# EasyEDA schematic SCH_Irrigation_controller_2022-02-15.json
TITLE: Irrigation Controller; REV: 1.0; Date: 2022-02-15; Sheet: 1/1; Drawn By: Fabrizio Fiorucci; Company: 65397
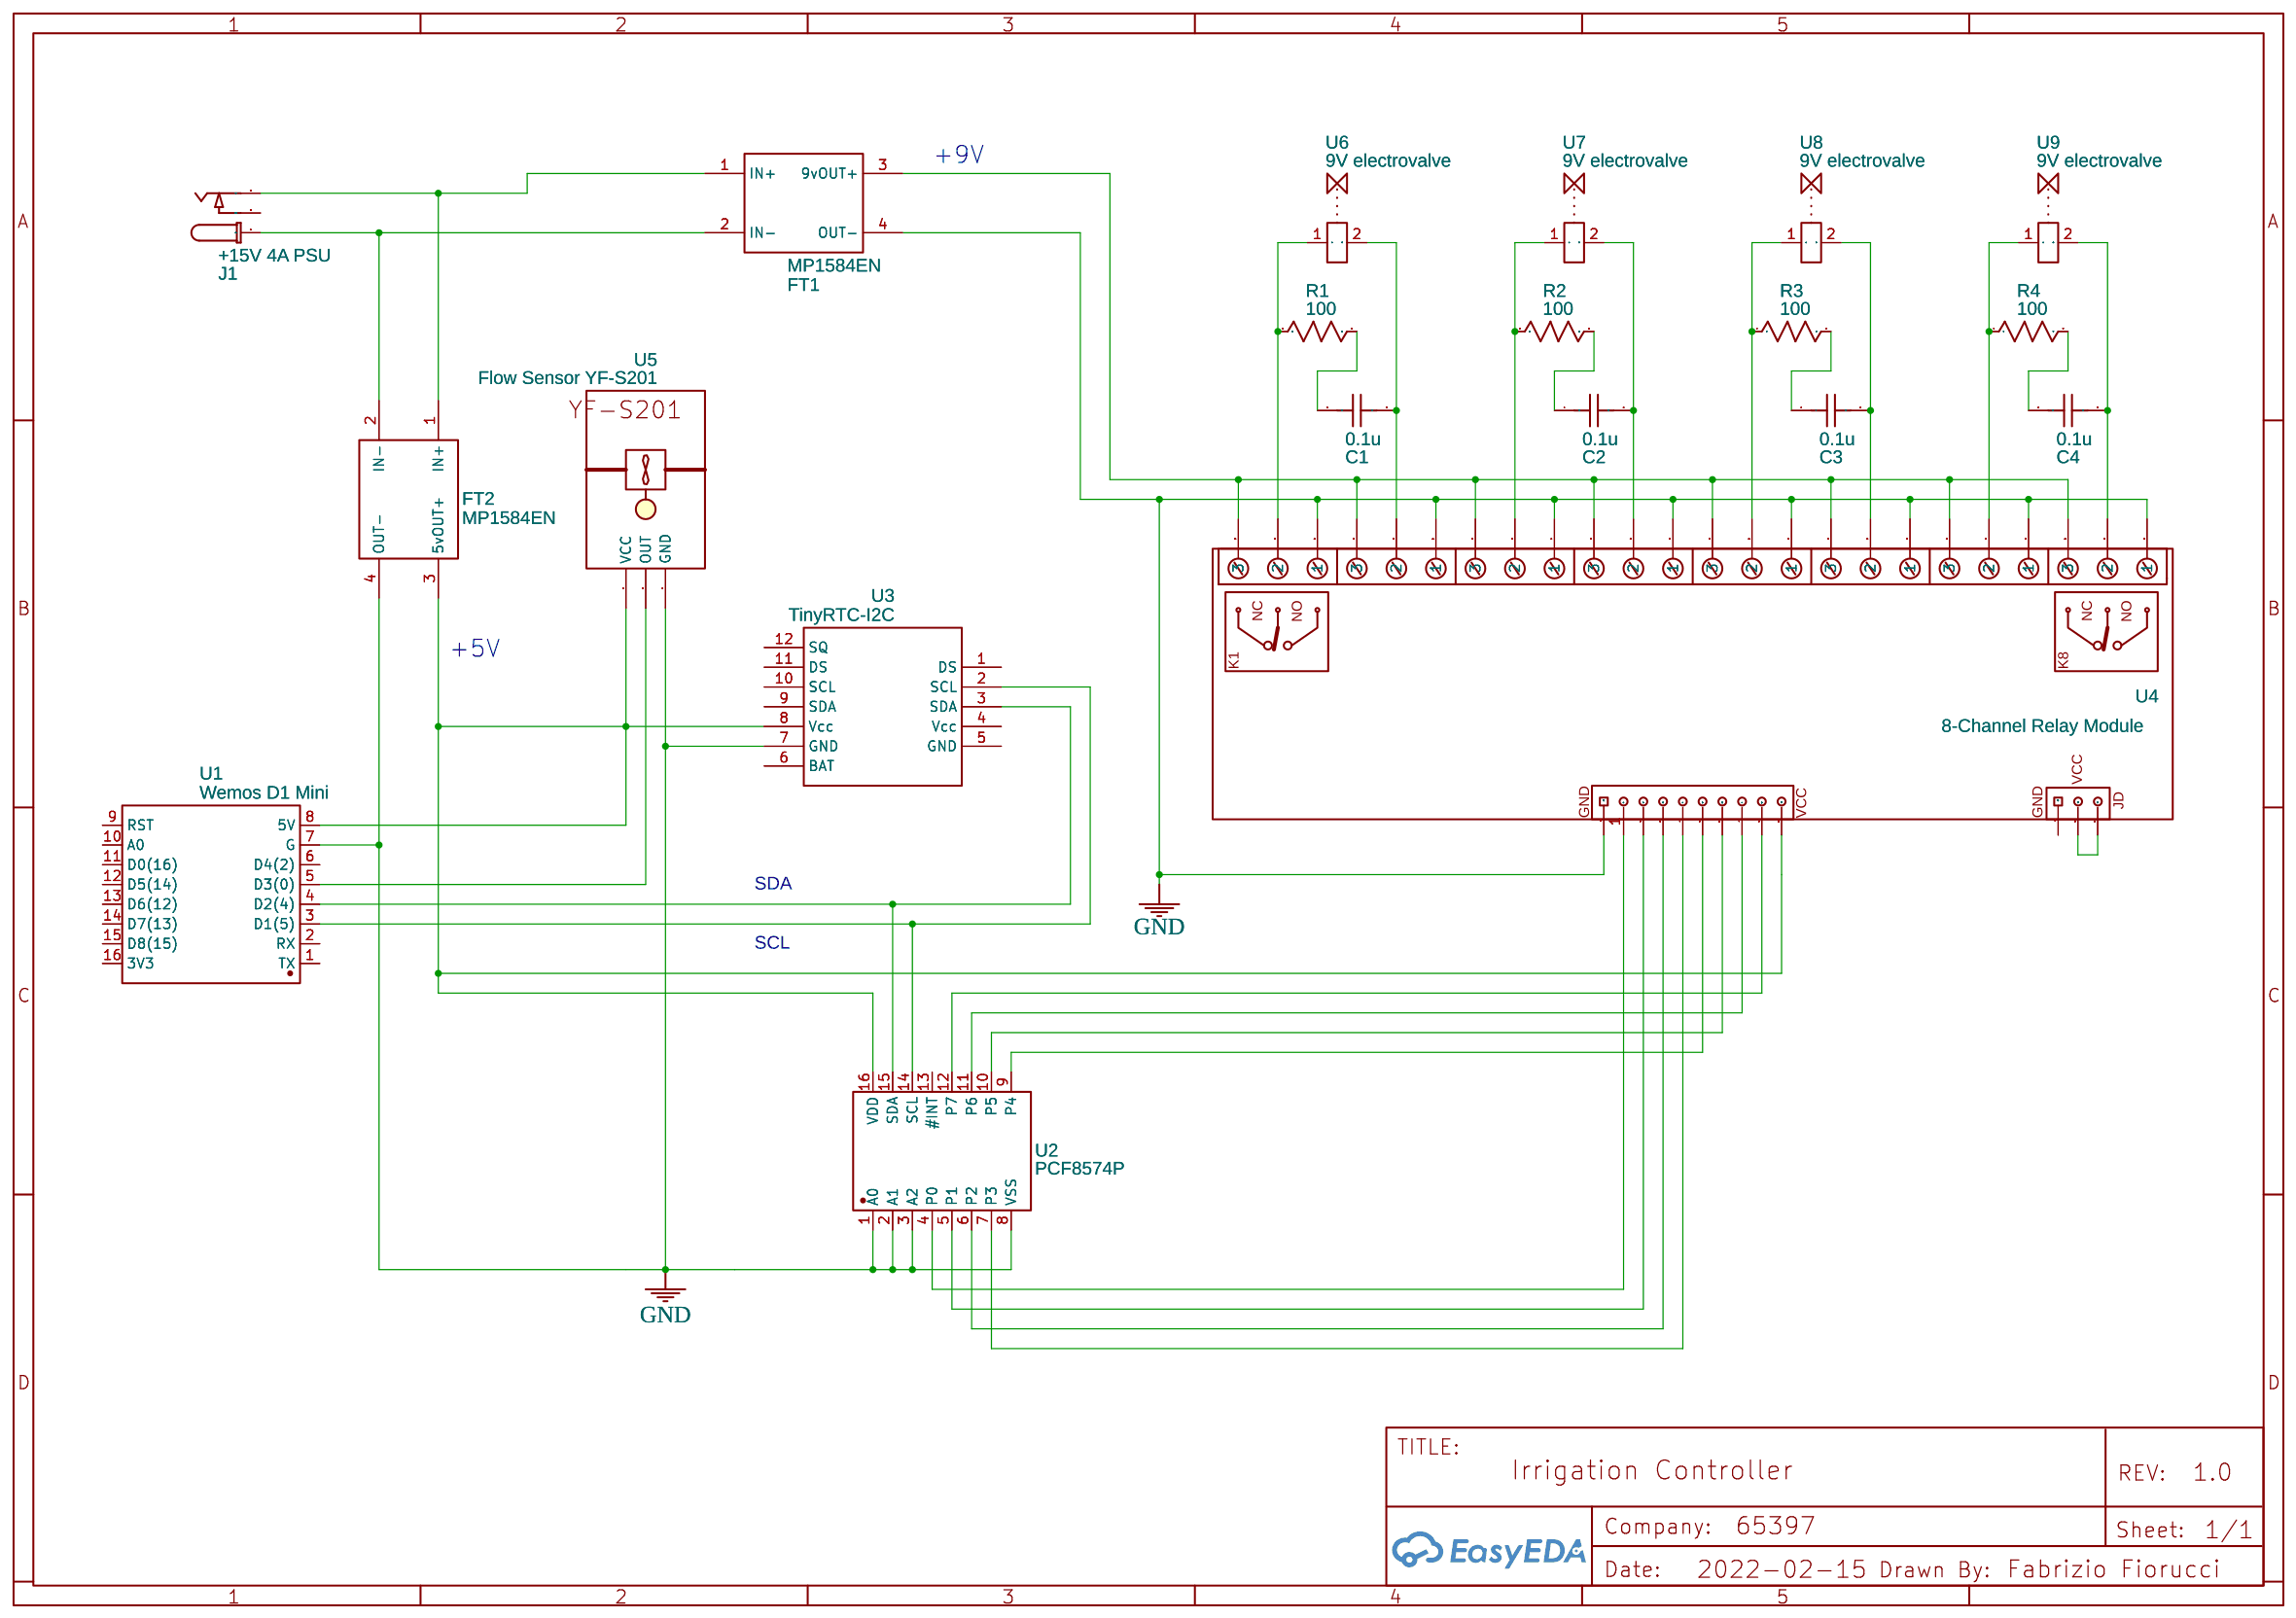
[diagram p0: schematic sheet]

## Parts
C1  0.1u  [C0603]
C2  0.1u  [C0603]
C3  0.1u  [C0603]
C4  0.1u  [C0603]
FT1  MP1584EN  [MP1584EN]
FT2  MP1584EN  [MP1584EN]
J1  +15V 4A PSU  [DC_BARREL_JACK_PTH_2MM]
R1  100  [R0603]
R2  100  [R0603]
R3  100  [R0603]
R4  100  [R0603]
U1  Wemos D1 Mini  [DIP-16_WEMOS_D1_MINI_PRO4]
U2  PCF8574P  [DIP-16_L19.3-W6.4-P2.54-LS7.6-BL]
U3  TinyRTC-I2C  [TINYRTC-I2C]
U4  8-Channel Relay Module  [8CH-RELAY-MODULE-UPDATED]
U5  Flow Sensor YF-S201
U6  9V electrovalve
U7  9V electrovalve
U8  9V electrovalve
U9  9V electrovalve

## Library data of the parts
C1-C4 = C_0603_US: Contributor: LCEDA_Lib
FT1 FT2 = MP1584EN: Contributor: Hardhu
J1 = CON_DC_M: Contributor: DangerousPrototype
R1-R4 = R_0603_US: Contributor: LCEDA_Lib
U1 = WEMOS_D1_MINI_PRO4: Supplier: LCSC; Supplier Part: C2837266; Manufacturer: null; Manufacturer Part: Wemos_D1_mini_Pro4; Contributor: LCSC; JLCPCB Part Class: Extended Part
U2 = PCF8574P: Supplier: LCSC; Supplier Part: C398073; Manufacturer: HGSEMI; Contributor: LCSC; JLCPCB Part Class: Extended Part
U3 = TinyRTC-I2C: Contributor: naber177; sourceId: uhNHBvN5Z
U4 = 8-Channel_Relay_Module: Manufacturer Part: 1-Channel 5V Relay Module w/ Opto-isolator; Supplier Part: SKU: 223429; link: http://www.volumerate.com/product/1-channel-5v-relay-module-w-opto-isolator-red-blue-223429; Contributor: jousterde1
U5 = Flow Sensor YF-S201: Supplier: US SOLID; Contributor: pauldesc
U6-U9 = electrovalve: Contributor: rmartinezr176

## Nets
GND: FT1.4(OUT-) FT2.4(OUT-) U1.7(G) U2.1(A0) U2.2(A1) U2.3(A2) U2.8(VSS) U3.7(GND) U4.21(1) U4.31(1) U4.41(1) U4.51(1) U4.61(1) U4.71(1) U4.81(1) U4.91(1) U4.GND U5.1(GND)
Net-(C1-1): C1.1 R1.2
Net-(C1-2): C1.2 U4.82(2) U6.2
Net-(C2-1): C2.1 R2.2
Net-(C2-2): C2.2 U4.62(2) U7.2
Net-(C3-1): C3.1 R3.2
Net-(C3-2): C3.2 U4.42(2) U8.2
Net-(C4-1): C4.1 R4.2
Net-(C4-2): C4.2 U4.22(2) U9.2
Net-(FT1-1): FT1.1(IN+) FT2.1(IN+) J1.P3(P2)
Net-(FT1-2): FT1.2(IN-) FT2.2(IN-) J1.P1
Net-(FT1-3): FT1.3(9vOUT+) U4.23(3) U4.33(3) U4.43(3) U4.53(3) U4.63(3) U4.73(3) U4.83(3) U4.93(3)
Net-(FT2-3): FT2.3(5vOUT+) U1.8(5V) U2.16(VDD) U3.8(Vcc) U4.11 U4.VCC U5.2(VCC)
Net-(R1-1): R1.1 U4.92(2) U6.1
Net-(R2-1): R2.1 U4.72(2) U7.1
Net-(R3-1): R3.1 U4.52(2) U8.1
Net-(R4-1): R4.1 U4.32(2) U9.1
Net-(U1-3): U1.3(D1(5)) U2.14(SCL) U3.2(SCL)
Net-(U1-4): U1.4(D2(4)) U2.15(SDA) U3.3(SDA)
Net-(U1-5): U1.5(D3(0)) U5.3(OUT)
Net-(U2-4): U2.4(P0) U4.1
Net-(U2-5): U2.5(P1) U4.2
Net-(U2-6): U2.6(P2) U4.3
Net-(U2-7): U2.7(P3) U4.4
Net-(U2-9): U2.9(P4) U4.5
Net-(U2-10): U2.10(P5) U4.6
Net-(U2-11): U2.11(P6) U4.7
Net-(U2-12): U2.12(P7) U4.8

Not connected (* = marked no-connect by the designer): J1 P2(P3); U1 1(TX) 2(RX) 6(D4(2)) 9(RST) 10(A0) 11(D0(16)) 12(D5(14)) 13(D6(12)) 14(D7(13)) 15(D8(15)) 16(3V3); U2 13(#INT); U3 1(DS) 4(Vcc) 5(GND) 6(BAT) 9(SDA) 10(SCL) 11(DS) 12(SQ)

## Notes on the sheet
- +9V
- +5V
- SDA
- SCL
